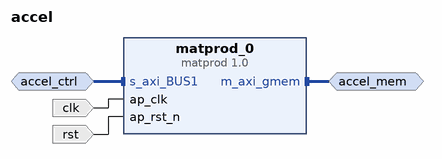
[diagram p0: block diagram of the top level]
# Vivado block design accel, xc7a100tcsg324-1, Vivado 2022.2
create_bd_design accel

create_bd_intf_port -mode Master -vlnv xilinx.com:interface:aximm_rtl:1.0 accel_mem
set_property -dict [list \
  CONFIG.ADDR_WIDTH 64 \
  CONFIG.DATA_WIDTH 32 \
  CONFIG.FREQ_HZ 50000000 \
  CONFIG.HAS_BURST 0 \
  CONFIG.NUM_READ_OUTSTANDING 16 \
  CONFIG.NUM_WRITE_OUTSTANDING 16 \
  CONFIG.PROTOCOL AXI4 \
] [get_bd_intf_ports accel_mem]
create_bd_intf_port -mode Slave -vlnv xilinx.com:interface:aximm_rtl:1.0 accel_ctrl
set_property -dict [list \
  CONFIG.ADDR_WIDTH 7 \
  CONFIG.ARUSER_WIDTH 0 \
  CONFIG.AWUSER_WIDTH 0 \
  CONFIG.BUSER_WIDTH 0 \
  CONFIG.DATA_WIDTH 32 \
  CONFIG.FREQ_HZ 50000000 \
  CONFIG.HAS_BRESP 1 \
  CONFIG.HAS_BURST 0 \
  CONFIG.HAS_CACHE 0 \
  CONFIG.HAS_LOCK 0 \
  CONFIG.HAS_PROT 0 \
  CONFIG.HAS_QOS 0 \
  CONFIG.HAS_REGION 0 \
  CONFIG.HAS_RRESP 1 \
  CONFIG.HAS_WSTRB 1 \
  CONFIG.ID_WIDTH 0 \
  CONFIG.MAX_BURST_LENGTH 1 \
  CONFIG.NUM_READ_OUTSTANDING 1 \
  CONFIG.NUM_READ_THREADS 1 \
  CONFIG.NUM_WRITE_OUTSTANDING 1 \
  CONFIG.NUM_WRITE_THREADS 1 \
  CONFIG.PROTOCOL AXI4LITE \
  CONFIG.READ_WRITE_MODE READ_WRITE \
  CONFIG.RUSER_BITS_PER_BYTE 0 \
  CONFIG.RUSER_WIDTH 0 \
  CONFIG.SUPPORTS_NARROW_BURST 0 \
  CONFIG.WUSER_BITS_PER_BYTE 0 \
  CONFIG.WUSER_WIDTH 0 \
] [get_bd_intf_ports accel_ctrl]
create_bd_port -dir I -type clk clk
set_property -dict {CONFIG.ASSOCIATED_BUSIF accel_mem:accel_ctrl CONFIG.FREQ_HZ 50000000} [get_bd_ports clk]
create_bd_port -dir I -type rst rst

create_bd_cell -type ip -vlnv xilinx.com:hls:matprod:1.0 matprod_0

# ---- connections ----

connect_bd_intf_net [get_bd_intf_ports accel_ctrl] [get_bd_intf_pins matprod_0/s_axi_BUS1]
connect_bd_intf_net [get_bd_intf_ports accel_mem] [get_bd_intf_pins matprod_0/m_axi_gmem]
connect_bd_net [get_bd_ports clk] [get_bd_pins matprod_0/ap_clk]
connect_bd_net [get_bd_ports rst] [get_bd_pins matprod_0/ap_rst_n]

# ---- address map ----
assign_bd_address -offset 0x0000 -range 128 -target_address_space [get_bd_addr_spaces accel_ctrl] [get_bd_addr_segs matprod_0/s_axi_BUS1/Reg]
assign_bd_address -offset 0x0000000000000000 -range 128M -target_address_space [get_bd_addr_spaces matprod_0/Data_m_axi_gmem] [get_bd_addr_segs accel_mem/Reg]

validate_bd_design
save_bd_design
